# Altium project Aspectu Communications Module.PrjPcb
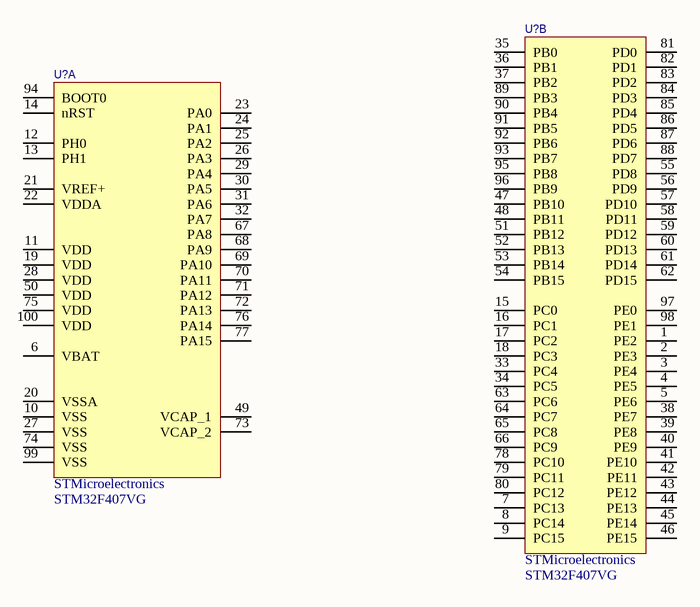
[diagram p0: MCU.SchDoc]
4 sheets, 122 parts. Net scope: global (net labels, ports and power ports of the same name join across sheets).
Sheets:
  MCU.SchDoc
  Power Amplifier.SchDoc
  Transmitter.SchDoc
  Receiver.SchDoc

## Sheet MCU.SchDoc
size A4

### Parts
(Parts that share a designator on the sheet are numbered #1, #2 ... from top to bottom, then left to right.)
U?#1  Manufacturer: STMicroelectronics  (hidden comment: STM32F407VG)  (part B of 2)
U?#2  Manufacturer: STMicroelectronics  (hidden comment: STM32F407VG)  (part A of 2)

### Nets

Not connected (* = marked no-connect by the designer): U?#1 1(PE2) 2(PE3) 3(PE4) 4(PE5) 5(PE6) 7(PC13) 8(PC14) 9(PC15) 15(PC0) 16(PC1) 17(PC2) 18(PC3) 33(PC4) 34(PC5) 35(PB0) 36(PB1) 37(PB2) 38(PE7) 39(PE8) 40(PE9) 41(PE10) 42(PE11) 43(PE12) 44(PE13) 45(PE14) 46(PE15) 47(PB10) 48(PB11) 51(PB12) 52(PB13) 53(PB14) 54(PB15) 55(PD8) 56(PD9) 57(PD10) 58(PD11) 59(PD12) 60(PD13) 61(PD14) 62(PD15) 63(PC6) 64(PC7) 65(PC8) 66(PC9) 78(PC10) 79(PC11) 80(PC12) 81(PD0) 82(PD1) 83(PD2) 84(PD3) 85(PD4) 86(PD5) 87(PD6) 88(PD7) 89(PB3) 90(PB4) 91(PB5) 92(PB6) 93(PB7) 95(PB8) 96(PB9) 97(PE0) 98(PE1); U?#2 6(VBAT) 10(VSS) 11(VDD) 12(PH0) 13(PH1) 14(nRST) 19(VDD) 20(VSSA) 21(VREF+) 22(VDDA) 23(PA0) 24(PA1) 25(PA2) 26(PA3) 27(VSS) 28(VDD) 29(PA4) 30(PA5) 31(PA6) 32(PA7) 49(VCAP_1) 50(VDD) 67(PA8) 68(PA9) 69(PA10) 70(PA11) 71(PA12) 72(PA13) 73(VCAP_2) 74(VSS) 75(VDD) 76(PA14) 77(PA15) 94(BOOT0) 99(VSS) 100(VDD)

### Library data of the parts
U?#1 U?#2 = STM32F407: Distributor: Digi-Key; Distributor Part Number: *; Manufacturer Part Number: STM32F407VG

## Sheet Power Amplifier.SchDoc
size A4
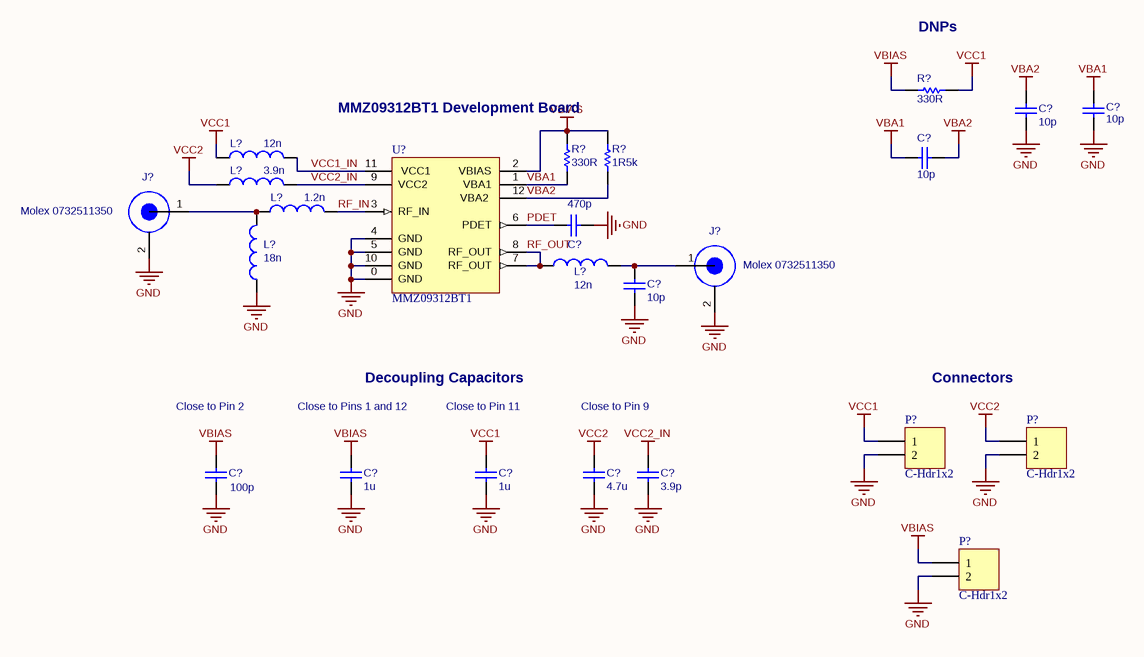
[diagram p1: Power Amplifier.SchDoc]

### Parts
(Parts that share a designator on the sheet are numbered #1, #2 ... from top to bottom, then left to right.)
C?#1  10p  [CAP 1005 (0402) B-Density]
C?#2  10p  [CAP 1005 (0402) B-Density]
C?#3  10p  [CAP 1005 (0402) B-Density]
C?#4  470p  [CAP 1005 (0402) B-Density]
C?#5  10p  [CAP 1005 (0402) B-Density]
C?#6  100p  [CAP 1005 (0402) B-Density]
C?#7  1u  [CAP 1005 (0402) B-Density]
C?#8  1u  [CAP 1005 (0402) B-Density]
C?#9  4.7u  [CAP 1608 (0603) B-Density]
C?#10  3.9p  [CAP 1005 (0402) B-Density]
J?#1  Molex 0732511350  [MOLEX 732511350]
J?#2  Molex 0732511350  [MOLEX 732511350]
L?#1  12n  [IND 1608 (0603)]
L?#2  3.9n  [IND 1608 (0603)]
L?#3  1.2n  [IND 1608 (0603)]
L?#4  12n  [IND 1608 (0603)]
L?#5  18n  [IND 1608 (0603)]
P?#1  C-Hdr1x2  [HDR1X2_LGE1.0]
P?#2  C-Hdr1x2  [HDR1X2_LGE1.0]
P?#3  C-Hdr1x2  [HDR1X2_LGE1.0]
R?#1  330R  [RES 1005 (0402)]
R?#2  330R  [RES 1005 (0402)]
R?#3  1R5k  [RES 1005 (0402)]
U?#3  MMZ09312BT1  [QFN 3x3]

### Nets
GND: C?#1.1 C?#2.1 C?#4.2 C?#5.1 C?#6.1 C?#7.1 C?#8.1 C?#9.1 C?#10.1 J?#1.2 J?#2.2 L?#5.1 P?#1.2 P?#2.2 P?#3.2 U?#3.0(GND) U?#3.4(GND) U?#3.5(GND) U?#3.10(GND)
VBA1: C?#2.2 C?#3.2 R?#2.1 U?#3.1(VBA1)
VBA2: C?#1.2 C?#3.1 R?#3.1 U?#3.12(VBA2)
VBIAS: C?#6.2 C?#7.2 P?#3.1 R?#1.2 R?#2.2 R?#3.2 U?#3.2(VBIAS)
VCC1: C?#8.2 L?#1.1 P?#1.1 R?#1.1
VCC2: C?#9.2 L?#2.1 P?#2.1
VCC2_IN: C?#10.2 L?#2.2 U?#3.9(VCC2)
PDET: C?#4.1 U?#3.6(PDET)
RF_IN: L?#3.2 U?#3.3(RF_IN)
RF_OUT: L?#4.1 U?#3.7(RF_OUT) U?#3.8(RF_OUT)
VCC1_IN: L?#1.2 U?#3.11(VCC1)
NetC?#5_2: C?#5.2 J?#2.1 L?#4.2
NetJ?#1_1: J?#1.1 L?#3.1 L?#5.2

### Notes on the sheet
- DNPs
- (near R?#2) MMZ09312BT1 Development Board
- Decoupling Capacitors
- Connectors
- Close to Pin 2
- Close to Pins 1 and 12
- Close to Pin 11
- Close to Pin 9

### Library data of the parts
C?#1-C?#10 = CAPACITOR (GENERAL): Capacitor; Supplier 1: Digi-Key
  C?#1-C?#3 C?#5: Supplier Part Number 1: 490-3113-1-ND; Value: *
  C?#4: Supplier Part Number 1: 490-1297-1-ND; Value: *
  C?#6: Supplier Part Number 1: 399-3194-1-ND; Value: *
  C?#7: Supplier Part Number 1: 1276-1076-1-ND; Value: 1u
  C?#8: Supplier Part Number 1: 1276-1076-1-ND; Value: *
  C?#9: Supplier Part Number 1: 490-7203-1-ND; Value: *
  C?#10: Supplier Part Number 1: 478-4424-1-ND; Value: *
J?#1 J?#2 = SMA CONNECTOR (GENERAL): Supplier 1: Digi-Key; Supplier Part Number 1: WM9357-ND
L?#1-L?#5 = INDUCTOR (GENERAL): Inductor; Supplier 1: Digi-Key; Value: *
  L?#1 L?#4: Supplier Part Number 1: 490-17900-1-ND
  L?#2: Supplier Part Number 1: 490-1105-1-ND
  L?#3: Supplier Part Number 1: 490-1099-1-ND
  L?#5: Supplier Part Number 1: 490-6577-1-ND
P?#1-P?#3 = C-Hdr1x2: Header, 2-Pin; LatestRevisionDate: 17-Jul-2002; LatestRevisionNote: Re-released for DXP Platform.; Publisher: Altium Limited; Supplier 1: Digi-Key; Supplier Part Number 1: 732-5315-ND
R?#1-R?#3 = RESISTOR (GENERAL): Resistor; Supplier 1: Digi-Key; Value: *
  R?#1 R?#2: Supplier Part Number 1: 311-330JRCT-ND
  R?#3: Supplier Part Number 1: 311-1.50KLRCT-ND
U?#3 = MMZ09312BT1: IC RF AMP CDMA 400MHZ-1GHZ 12QFN; Supplier 1: Digi-Key; Supplier Part Number 1: MMZ09312BT1TR-ND

## Sheet Transmitter.SchDoc
size A4
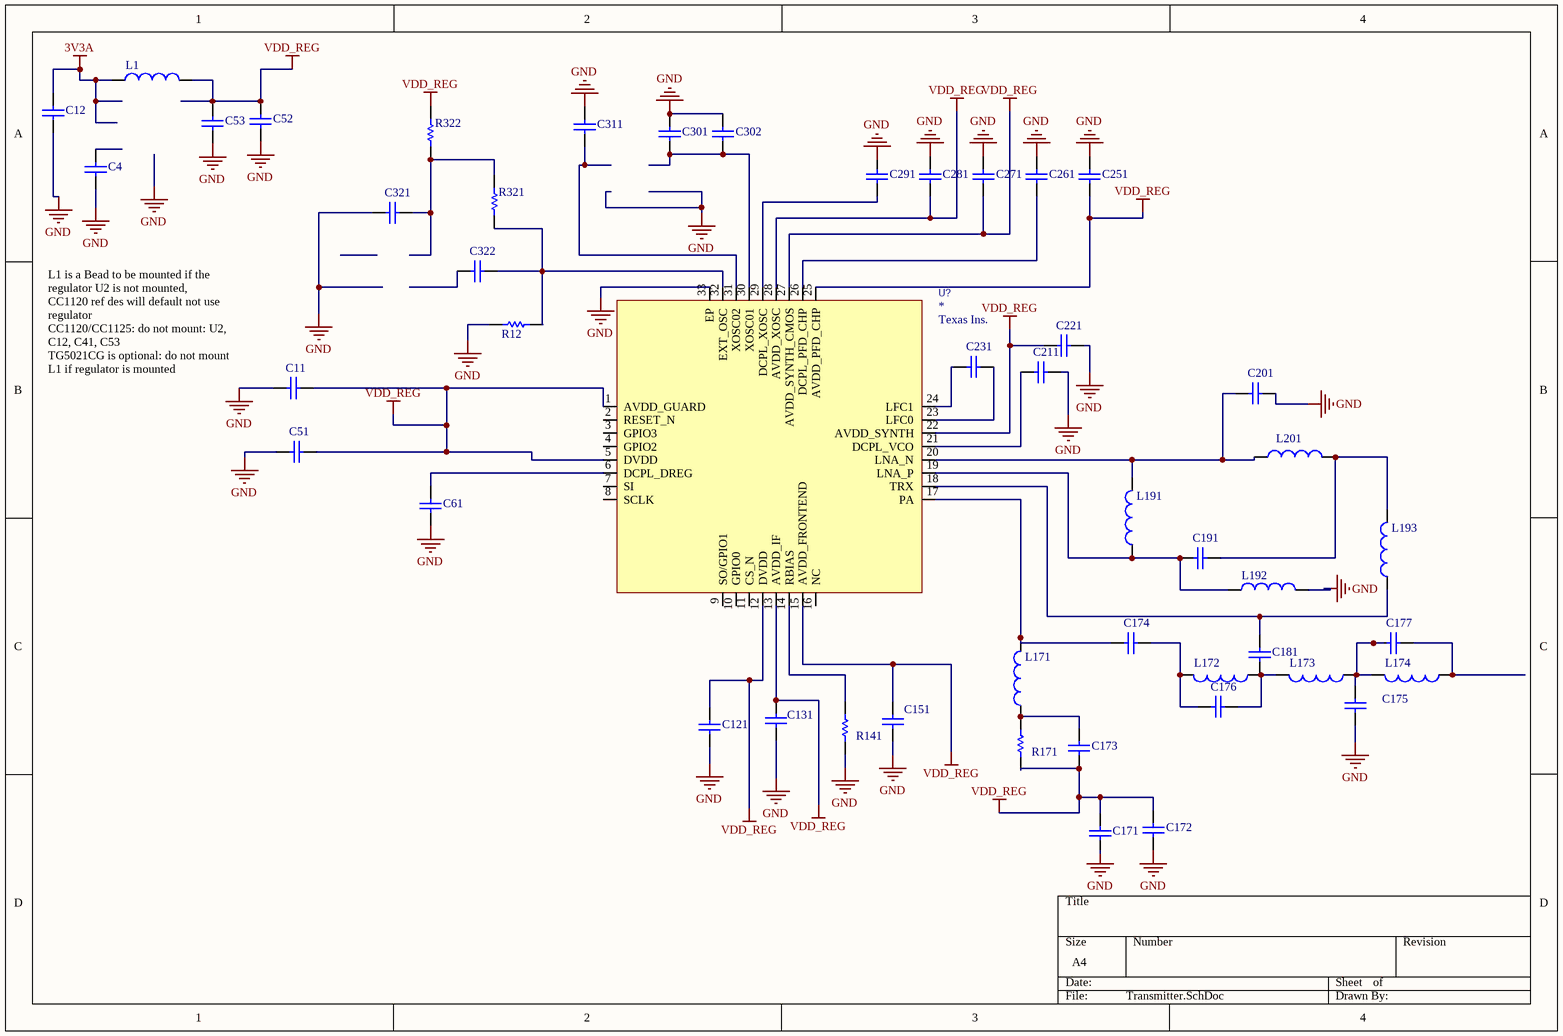
[diagram p2: Transmitter.SchDoc]

### Parts
(Parts that share a designator on the sheet are numbered #1, #2 ... from top to bottom, then left to right.)
C4  CAPACITOR (GENERAL)  [C0805]  (value not drawn)
C11#1  CAPACITOR (GENERAL)  [C0805]  (value not drawn)
C12#1  CAPACITOR (GENERAL)  [C0805]  (value not drawn)
C51#1  CAPACITOR (GENERAL)  [C0805]  (value not drawn)
C52#1  CAPACITOR (GENERAL)  [C0805]  (value not drawn)
C53#1  CAPACITOR (GENERAL)  [C0805]  (value not drawn)
C61#1  CAPACITOR (GENERAL)  [C0805]  (value not drawn)
C121#1  CAPACITOR (GENERAL)  [C0805]  (value not drawn)
C131#1  CAPACITOR (GENERAL)  [C0805]  (value not drawn)
C151#1  CAPACITOR (GENERAL)  [C0805]  (value not drawn)
C171#1  CAPACITOR (GENERAL)  [C0805]  (value not drawn)
C172#1  CAPACITOR (GENERAL)  [C0805]  (value not drawn)
C173#1  CAPACITOR (GENERAL)  [C0805]  (value not drawn)
C174#1  CAPACITOR (GENERAL)  [C0805]  (value not drawn)
C175#1  CAPACITOR (GENERAL)  [C0805]  (value not drawn)
C176#1  CAPACITOR (GENERAL)  [C0805]  (value not drawn)
C177#1  CAPACITOR (GENERAL)  [C0805]  (value not drawn)
C181#1  CAPACITOR (GENERAL)  [C0805]  (value not drawn)
C191#1  CAPACITOR (GENERAL)  [C0805]  (value not drawn)
C201#1  CAPACITOR (GENERAL)  [C0805]  (value not drawn)
C211#1  CAPACITOR (GENERAL)  [C0805]  (value not drawn)
C221#1  CAPACITOR (GENERAL)  [C0805]  (value not drawn)
C231#1  CAPACITOR (GENERAL)  [C0805]  (value not drawn)
C251#1  CAPACITOR (GENERAL)  [C0805]  (value not drawn)
C261#1  CAPACITOR (GENERAL)  [C0805]  (value not drawn)
C271#1  CAPACITOR (GENERAL)  [C0805]  (value not drawn)
C281#1  CAPACITOR (GENERAL)  [C0805]  (value not drawn)
C291#1  CAPACITOR (GENERAL)  [C0805]  (value not drawn)
C301#1  CAPACITOR (GENERAL)  [C0805]  (value not drawn)
C302#1  CAPACITOR (GENERAL)  [C0805]  (value not drawn)
C311#1  CAPACITOR (GENERAL)  [C0805]  (value not drawn)
C321#1  CAPACITOR (GENERAL)  [C0805]  (value not drawn)
C322#1  CAPACITOR (GENERAL)  [C0805]  (value not drawn)
L1#1  INDUCTOR (GENERAL)  [0402-A]  (value not drawn)
L171#1  INDUCTOR (GENERAL)  [0402-A]  (value not drawn)
L172#1  INDUCTOR (GENERAL)  [0402-A]  (value not drawn)
L173#1  INDUCTOR (GENERAL)  [0402-A]  (value not drawn)
L174#1  INDUCTOR (GENERAL)  [0402-A]  (value not drawn)
L191#1  INDUCTOR (GENERAL)  [0402-A]  (value not drawn)
L192#1  INDUCTOR (GENERAL)  [0402-A]  (value not drawn)
L193#1  INDUCTOR (GENERAL)  [0402-A]  (value not drawn)
L201#1  INDUCTOR (GENERAL)  [0402-A]  (value not drawn)
R12#1  RESISTOR (GENERAL)  (value not drawn)
R141#1  RESISTOR (GENERAL)  (value not drawn)
R171#1  RESISTOR (GENERAL)  (value not drawn)
R321#1  RESISTOR (GENERAL)  (value not drawn)
R322#1  RESISTOR (GENERAL)  (value not drawn)
U?#4  Manufacturer: Texas Ins.  (hidden comment: CC1120)

### Nets
3V3A: C12#1.1 L1#1.1
GND: C4.2 C11#1.2 C12#1.2 C51#1.2 C52#1.2 C53#1.2 C61#1.2 C121#1.2 C131#1.2 C151#1.2 C171#1.2 C172#1.2 C175#1.2 C201#1.1 C211#1.2 C221#1.2 C251#1.2 C261#1.2 C271#1.2 C281#1.2 C301#1.2 C302#1.2 C311#1.2 C321#1.2 L192#1.2 R12#1.2 R141#1.2 U?#4.33(EP)
VDD_REG: C11#1.1 C51#1.1 C52#1.1 C53#1.1 C121#1.1 C131#1.1 C151#1.1 C171#1.1 C172#1.1 C173#1.2 C221#1.1 C251#1.1 C271#1.1 C281#1.1 L1#1.2 R171#1.2 R322#1.2 U?#4.1(AVDD_GUARD) U?#4.5(DVDD) U?#4.12(DVDD) U?#4.13(AVDD_IF) U?#4.15(AVDD_FRONTEND) U?#4.22(AVDD_SYNTH) U?#4.25(AVDD_PFD_CHP) U?#4.27(AVDD_SYNTH_CMOS) U?#4.28(AVDD_XOSC)
NetC61#1_1: C61#1.1 U?#4.6(DCPL_DREG)
NetC173#1_1: C173#1.1 L171#1.1 R171#1.1
NetC174#1_1: C174#1.1 L171#1.2 U?#4.17(PA)
NetC174#1_2: C174#1.2 C176#1.2 L172#1.2
NetC175#1_1: C175#1.1 C177#1.1 L173#1.1 L174#1.2
NetC176#1_1: C176#1.1 C181#1.2 L172#1.1 L173#1.2
NetC177#1_2: C177#1.2 L174#1.1
NetC181#1_1: C181#1.1 L193#1.1 U?#4.18(TRX)
NetC191#1_1: C191#1.1 L193#1.2 L201#1.2
NetC191#1_2: C191#1.2 L191#1.1 L192#1.1 U?#4.19(LNA_P)
NetC201#1_2: C201#1.2 L191#1.2 L201#1.1 U?#4.20(LNA_N)
NetC211#1_1: C211#1.1 U?#4.21(DCPL_VCO)
NetC231#1_1: C231#1.1 U?#4.23(LFC0)
NetC231#1_2: C231#1.2 U?#4.24(LFC1)
NetC261#1_1: C261#1.1 U?#4.26(DCPL_PFD_CHP)
NetC291#1_1: C291#1.1 U?#4.29(DCPL_XOSC)
NetC301#1_1: C301#1.1 C302#1.1 U?#4.30(XOSC01)
NetC311#1_1: C311#1.1 U?#4.31(XOSC02)
NetC321#1_1: C321#1.1 R321#1.2 R322#1.1
NetC322#1_1: C322#1.1 R12#1.1 R321#1.1 U?#4.32(EXT_OSC)
NetR141#1_1: R141#1.1 U?#4.14(RBIAS)

Not connected (* = marked no-connect by the designer): C4 1; C291#1 2; C322#1 2; U?#4 2(RESET_N) 3(GPIO3) 4(GPIO2) 7(SI) 8(SCLK) 9(SO/GPIO1) 10(GPIO0) 11(CS_N) 16(NC)

### Notes on the sheet
- L1 is a Bead to be mounted if the regulator U2 is not mounted,
  CC1120 ref des will default not use regulator
  CC1120/CC1125: do not mount: U2, C12, C41, C53
  TG5021CG is optional: do not mount L1 if regulator is mounted
- Labels drawn without touching a wire or pin: GND

### Library data of the parts
C4 C11#1 C12#1 C51#1 C52#1 C53#1 C61#1 C121#1 C131#1 C151#1 C171#1 C172#1 C173#1 C174#1 C175#1 C176#1 C177#1 C181#1 C191#1 C201#1 C211#1 C221#1 C231#1 C251#1 C261#1 C271#1 C281#1 C291#1 C301#1 C302#1 C311#1 C321#1 C322#1 = CAPACITOR (GENERAL): Capacitor; Supplier 1: Digi-Key; Supplier Part Number 1: *; Value: *
L1#1 L171#1 L172#1 L173#1 L174#1 L191#1 L192#1 L193#1 L201#1 = INDUCTOR (GENERAL): Inductor; Supplier 1: Digi-Key; Supplier Part Number 1: *; Value: *
R12#1 R141#1 R171#1 R321#1 R322#1 = RESISTOR (GENERAL): Resistor; Supplier 1: Digi-Key; Supplier Part Number 1: TBD; Value: *
U?#4 = CC1120: Distributor: Digi-Key; Distributor Part Number: *; Manufacturer Part Number: *

## Sheet Receiver.SchDoc
size A4
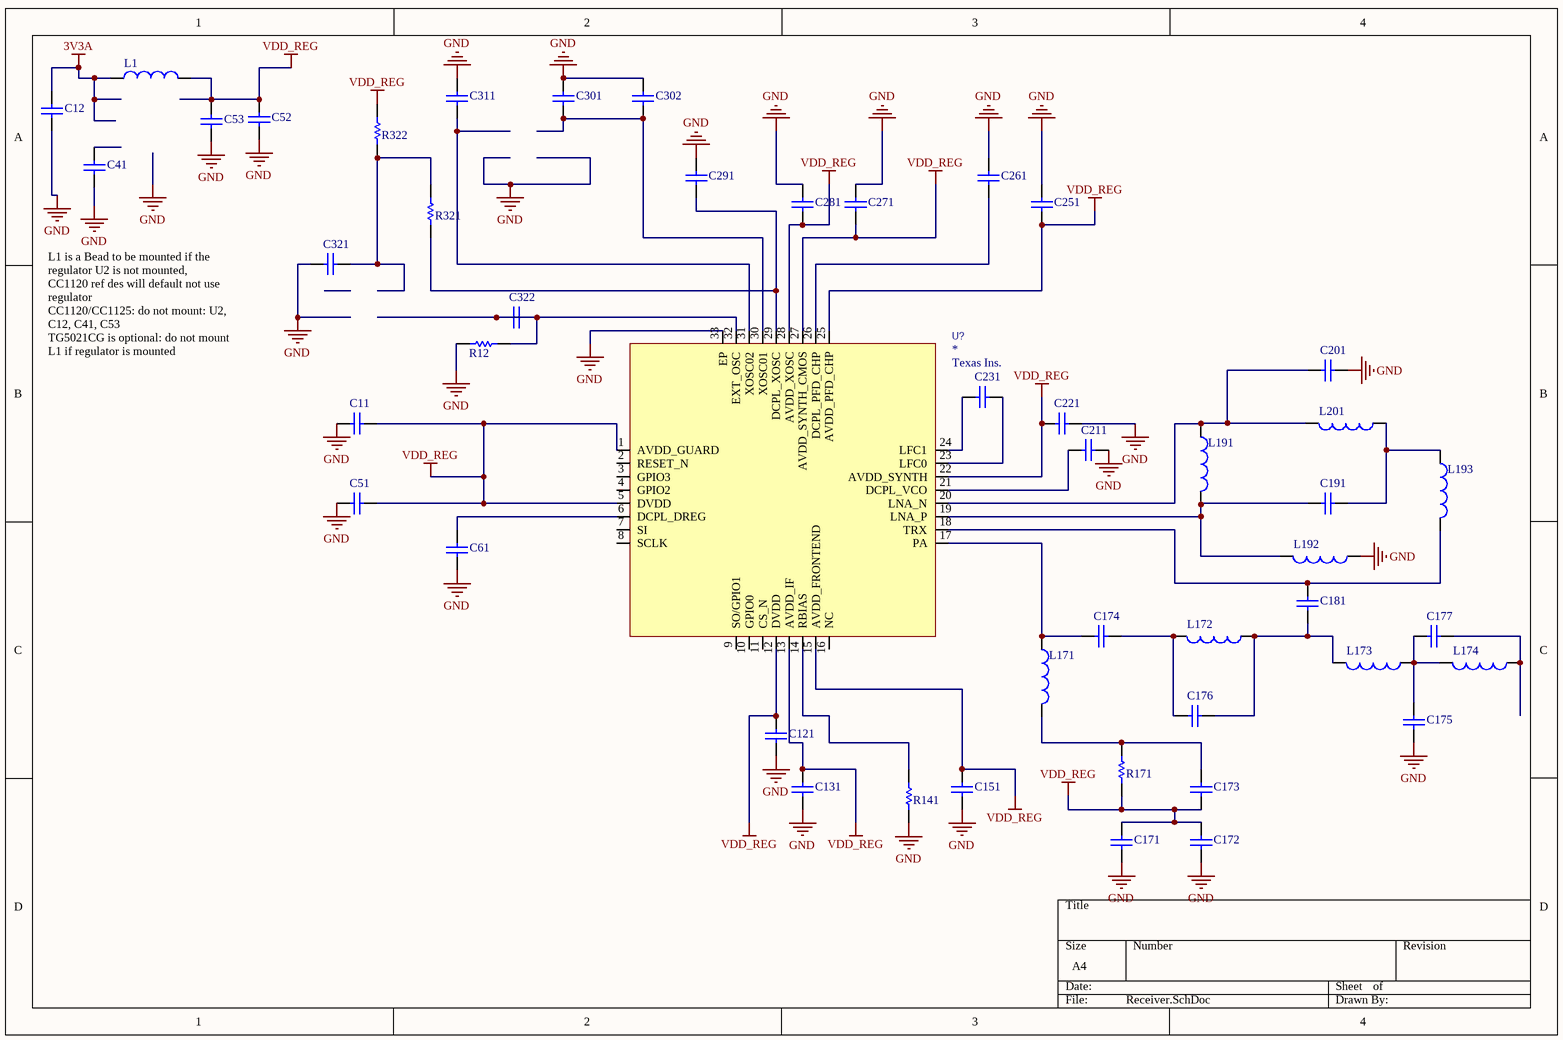
[diagram p3: Receiver.SchDoc]

### Parts
(Parts that share a designator on the sheet are numbered #1, #2 ... from top to bottom, then left to right.)
C11#2  CAPACITOR (GENERAL)  [C0805]  (value not drawn)
C12#2  CAPACITOR (GENERAL)  [C0805]  (value not drawn)
C41  CAPACITOR (GENERAL)  [C0805]  (value not drawn)
C51#2  CAPACITOR (GENERAL)  [C0805]  (value not drawn)
C52#2  CAPACITOR (GENERAL)  [C0805]  (value not drawn)
C53#2  CAPACITOR (GENERAL)  [C0805]  (value not drawn)
C61#2  CAPACITOR (GENERAL)  [C0805]  (value not drawn)
C121#2  CAPACITOR (GENERAL)  [C0805]  (value not drawn)
C131#2  CAPACITOR (GENERAL)  [C0805]  (value not drawn)
C151#2  CAPACITOR (GENERAL)  [C0805]  (value not drawn)
C171#2  CAPACITOR (GENERAL)  [C0805]  (value not drawn)
C172#2  CAPACITOR (GENERAL)  [C0805]  (value not drawn)
C173#2  CAPACITOR (GENERAL)  [C0805]  (value not drawn)
C174#2  CAPACITOR (GENERAL)  [C0805]  (value not drawn)
C175#2  CAPACITOR (GENERAL)  [C0805]  (value not drawn)
C176#2  CAPACITOR (GENERAL)  [C0805]  (value not drawn)
C177#2  CAPACITOR (GENERAL)  [C0805]  (value not drawn)
C181#2  CAPACITOR (GENERAL)  [C0805]  (value not drawn)
C191#2  CAPACITOR (GENERAL)  [C0805]  (value not drawn)
C201#2  CAPACITOR (GENERAL)  [C0805]  (value not drawn)
C211#2  CAPACITOR (GENERAL)  [C0805]  (value not drawn)
C221#2  CAPACITOR (GENERAL)  [C0805]  (value not drawn)
C231#2  CAPACITOR (GENERAL)  [C0805]  (value not drawn)
C251#2  CAPACITOR (GENERAL)  [C0805]  (value not drawn)
C261#2  CAPACITOR (GENERAL)  [C0805]  (value not drawn)
C271#2  CAPACITOR (GENERAL)  [C0805]  (value not drawn)
C281#2  CAPACITOR (GENERAL)  [C0805]  (value not drawn)
C291#2  CAPACITOR (GENERAL)  [C0805]  (value not drawn)
C301#2  CAPACITOR (GENERAL)  [C0805]  (value not drawn)
C302#2  CAPACITOR (GENERAL)  [C0805]  (value not drawn)
C311#2  CAPACITOR (GENERAL)  [C0805]  (value not drawn)
C321#2  CAPACITOR (GENERAL)  [C0805]  (value not drawn)
C322#2  CAPACITOR (GENERAL)  [C0805]  (value not drawn)
L1#2  INDUCTOR (GENERAL)  [0402-A]  (value not drawn)
L171#2  INDUCTOR (GENERAL)  [0402-A]  (value not drawn)
L172#2  INDUCTOR (GENERAL)  [0402-A]  (value not drawn)
L173#2  INDUCTOR (GENERAL)  [0402-A]  (value not drawn)
L174#2  INDUCTOR (GENERAL)  [0402-A]  (value not drawn)
L191#2  INDUCTOR (GENERAL)  [0402-A]  (value not drawn)
L192#2  INDUCTOR (GENERAL)  [0402-A]  (value not drawn)
L193#2  INDUCTOR (GENERAL)  [0402-A]  (value not drawn)
L201#2  INDUCTOR (GENERAL)  [0402-A]  (value not drawn)
R12#2  RESISTOR (GENERAL)  (value not drawn)
R141#2  RESISTOR (GENERAL)  (value not drawn)
R171#2  RESISTOR (GENERAL)  (value not drawn)
R321#2  RESISTOR (GENERAL)  (value not drawn)
R322#2  RESISTOR (GENERAL)  (value not drawn)
U?#5  Manufacturer: Texas Ins.  (hidden comment: CC1120)

### Nets
3V3A: C12#2.1 L1#2.1
GND: C11#2.2 C12#2.2 C41.2 C51#2.2 C52#2.2 C53#2.2 C61#2.2 C121#2.2 C131#2.2 C151#2.2 C171#2.1 C172#2.1 C175#2.2 C201#2.2 C211#2.2 C221#2.2 C251#2.2 C261#2.2 C271#2.2 C281#2.2 C291#2.2 C301#2.2 C302#2.2 C311#2.2 C321#2.2 L192#2.1 R12#2.1 R141#2.1 U?#5.33(EP)
VDD_REG: C11#2.1 C51#2.1 C52#2.1 C53#2.1 C121#2.1 C131#2.1 C151#2.1 C171#2.2 C172#2.2 C173#2.1 C221#2.1 C251#2.1 C271#2.1 C281#2.1 L1#2.2 R171#2.1 R322#2.2 U?#5.1(AVDD_GUARD) U?#5.5(DVDD) U?#5.12(DVDD) U?#5.13(AVDD_IF) U?#5.15(AVDD_FRONTEND) U?#5.22(AVDD_SYNTH) U?#5.25(AVDD_PFD_CHP) U?#5.27(AVDD_SYNTH_CMOS) U?#5.28(AVDD_XOSC)
NetC61#2_1: C61#2.1 U?#5.6(DCPL_DREG)
NetC173#2_2: C173#2.2 L171#2.2 R171#2.2
NetC174#2_1: C174#2.1 C176#2.2 L172#2.2
NetC174#2_2: C174#2.2 L171#2.1 U?#5.17(PA)
NetC175#2_1: C175#2.1 C177#2.2 L173#2.1 L174#2.2
NetC176#2_1: C176#2.1 C181#2.1 L172#2.1 L173#2.2
NetC177#2_1: C177#2.1 L174#2.1
NetC181#2_2: C181#2.2 L193#2.2 U?#5.18(TRX)
NetC191#2_1: C191#2.1 L191#2.2 L192#2.2 U?#5.19(LNA_P)
NetC191#2_2: C191#2.2 L193#2.1 L201#2.1
NetC201#2_1: C201#2.1 L191#2.1 L201#2.2 U?#5.20(LNA_N)
NetC211#2_1: C211#2.1 U?#5.21(DCPL_VCO)
NetC231#2_1: C231#2.1 U?#5.23(LFC0)
NetC231#2_2: C231#2.2 U?#5.24(LFC1)
NetC261#2_1: C261#2.1 U?#5.26(DCPL_PFD_CHP)
NetC291#2_1: C291#2.1 R321#2.2 U?#5.29(DCPL_XOSC)
NetC301#2_1: C301#2.1 C302#2.1 U?#5.30(XOSC01)
NetC311#2_1: C311#2.1 U?#5.31(XOSC02)
NetC321#2_1: C321#2.1 R321#2.1 R322#2.1
NetC322#2_1: C322#2.1 C322#2.2 R12#2.2 U?#5.32(EXT_OSC)
NetR141#2_2: R141#2.2 U?#5.14(RBIAS)

Not connected (* = marked no-connect by the designer): C41 1; U?#5 2(RESET_N) 3(GPIO3) 4(GPIO2) 7(SI) 8(SCLK) 9(SO/GPIO1) 10(GPIO0) 11(CS_N) 16(NC)

### Notes on the sheet
- L1 is a Bead to be mounted if the regulator U2 is not mounted,
  CC1120 ref des will default not use regulator
  CC1120/CC1125: do not mount: U2, C12, C41, C53
  TG5021CG is optional: do not mount L1 if regulator is mounted

### Library data of the parts
C11#2 C12#2 C41 C51#2 C52#2 C53#2 C61#2 C121#2 C131#2 C151#2 C171#2 C172#2 C173#2 C174#2 C175#2 C176#2 C177#2 C181#2 C191#2 C201#2 C211#2 C221#2 C231#2 C251#2 C261#2 C271#2 C281#2 C291#2 C301#2 C302#2 C311#2 C321#2 C322#2 = CAPACITOR (GENERAL): Capacitor; Supplier 1: Digi-Key; Supplier Part Number 1: *; Value: *
L1#2 L171#2 L172#2 L173#2 L174#2 L191#2 L192#2 L193#2 L201#2 = INDUCTOR (GENERAL): Inductor; Supplier 1: Digi-Key; Supplier Part Number 1: *; Value: *
R12#2 R141#2 R171#2 R321#2 R322#2 = RESISTOR (GENERAL): Resistor; Supplier 1: Digi-Key; Supplier Part Number 1: TBD; Value: *
U?#5 = CC1120: Distributor: Digi-Key; Distributor Part Number: *; Manufacturer Part Number: *

## Nets that join several sheets
3V3A: Transmitter (C12#1.1 L1#1.1), Receiver (C12#2.1 L1#2.1)
GND: Power Amplifier (19 pins), Transmitter (28 pins), Receiver (29 pins)
VDD_REG: Transmitter (26 pins), Receiver (26 pins)